# Altium project ESP-OLED.PrjPcb
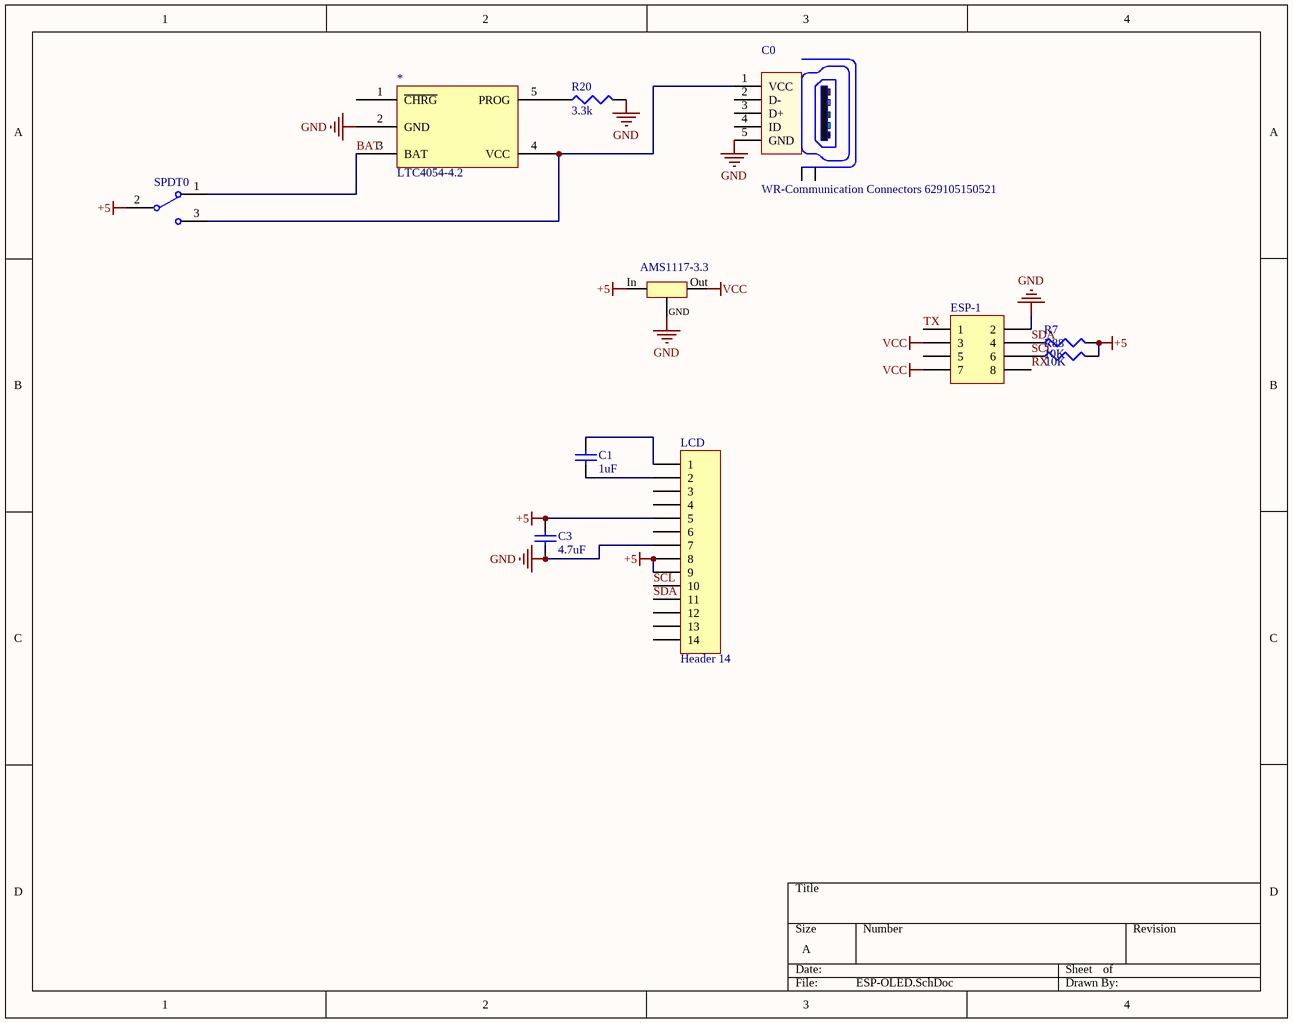
[diagram p0: ESP-OLED.SchDoc]
1 sheet, 11 parts. Net scope: global (net labels, ports and power ports of the same name join across sheets).
Board file: ESP-OLED.PcbDoc

## Sheet ESP-OLED.SchDoc
size A

### Parts
*  LTC4054-4.2  [S5]
C0  WR-Communication Connectors 629105150521  [629105150521_no_fixtures]
C1  value 1uF  [1608[0603]]  (hidden comment: Cap Semi)
C3  value 4.7uF  [1608[0603]]  (hidden comment: Cap Semi)
ESP-1  Header 4X2  [ESP-01]  (value not drawn)
LCD  Header 14  [OLED0.49]
R7  value 10K  [J1-0603]  (hidden comment: Res3)
R20  value 3.3k  [J1-0603]  (hidden comment: Res3)
R88  value 10K  [J1-0603]  (hidden comment: Res3)
reg  AMS1117-3.3  [SOT223]
SPDT0  450404015514  [450404015514]  (value not drawn)

### Nets
+5: C3.2 LCD.5 LCD.8 LCD.9 R7.2 R88.2 reg.3 SPDT0.2(COM)
GND: *.2(GND) C0.5(GND) C3.1 ESP-1.2 LCD.7 R20.2 reg.1
VCC: ESP-1.3 ESP-1.7 reg.2
BAT: *.3(BAT) SPDT0.1
RX: ESP-1.8
SCL: ESP-1.6 LCD.10 R88.1
SDA: ESP-1.4 LCD.11 R7.1
TX: ESP-1.1
Net*_4: *.4(VCC) C0.1(VCC) SPDT0.3
Net*_5: *.5(PROG) R20.1
NetC1_1: C1.1 LCD.2
NetC1_2: C1.2 LCD.1

Not connected (* = marked no-connect by the designer): * 1(~{CHRG}); C0 2(D-) 3(D+) 4(ID) Z1(Shield) Z2(Shield); ESP-1 5; LCD 3 4 6 12 13 14

### Notes on the sheet
- (in symbol AMS1117-3.3) In; Out; GND

### Library data of the parts
C0 = WR-Communication Connectors 629105150521: WR-COM_USB_Micro Type B_Horizontal_SMT; Manufacturer: Würth Elektronik eiSos GmbH; ComponentLink1 Description: Manufacturer; ComponentLink2 Description: Datasheet; NoPins: 5; ComponentLink1URL: http://www.we-online.de; ComponentLink2URL: http://katalog.we-online.de/em/datasheet/629105150521.pdf; Created by: Karrer Zheng; Created Date: 10/21/2014; partNo: 629105150521
C1 C3 = Cap Semi: Capacitor (Semiconductor SIM Model); Published: 8-Jun-2000; LatestRevisionDate: 29-May-2009; LatestRevisionNote: IPC-7351 Footprint Added.; PackageReference: C1206; Publisher: Altium Limited; PackageDescription: Chip Capacitor
ESP-1 = Header 4X2: Header, 4-Pin, Dual row; LatestRevisionDate: 17-Jul-2002; LatestRevisionNote: Re-released for DXP Platform.; Publisher: Altium Limited
LCD = Header 14: Header, 14-Pin; LatestRevisionDate: 17-Jul-2002; LatestRevisionNote: Re-released for DXP Platform.; Publisher: Altium Limited
R7 R20 R88 = Res3: Resistor; Published: 8-Jun-2000; LatestRevisionDate: 29-May-2009; LatestRevisionNote: IPC-7351 Footprint Added.; PackageReference: J1-0603; Publisher: Altium Limited; PackageDescription: Chip Resistor
SPDT0 = 450404015514: WS-SLSU Mini SMT Slide Switch, Same Side Connection, Right Angled, SPDT; pin to pad: 1>3 3>1; Rated Current: 300mA; Rated Voltage: 5VDC; Switching Function: On-On; ComponentLink1Description: Manufacturer; ComponentLink1URL: http://www.we-online.de; ComponentLink2Description: Datasheet; ComponentLink2URL: https://katalog.we-online.com/em/datasheet/450404015514.pdf; Packaging: Tape and Reel; Publisher: Wurth Elektronik; Contact Material: Copper Alloy; Mounting Technology: SMT; Operating Temperature: -40 to +85degC; Contact Plating: Silver; Part Number: 450404015514; Published Date: September 2019; Terminal Material: Copper Alloy; Size: 6.7x2.7mm; Circuit: SPDT; Terminal Plating: Silver